# Altium project BlackChat Digital Final.PrjPCB
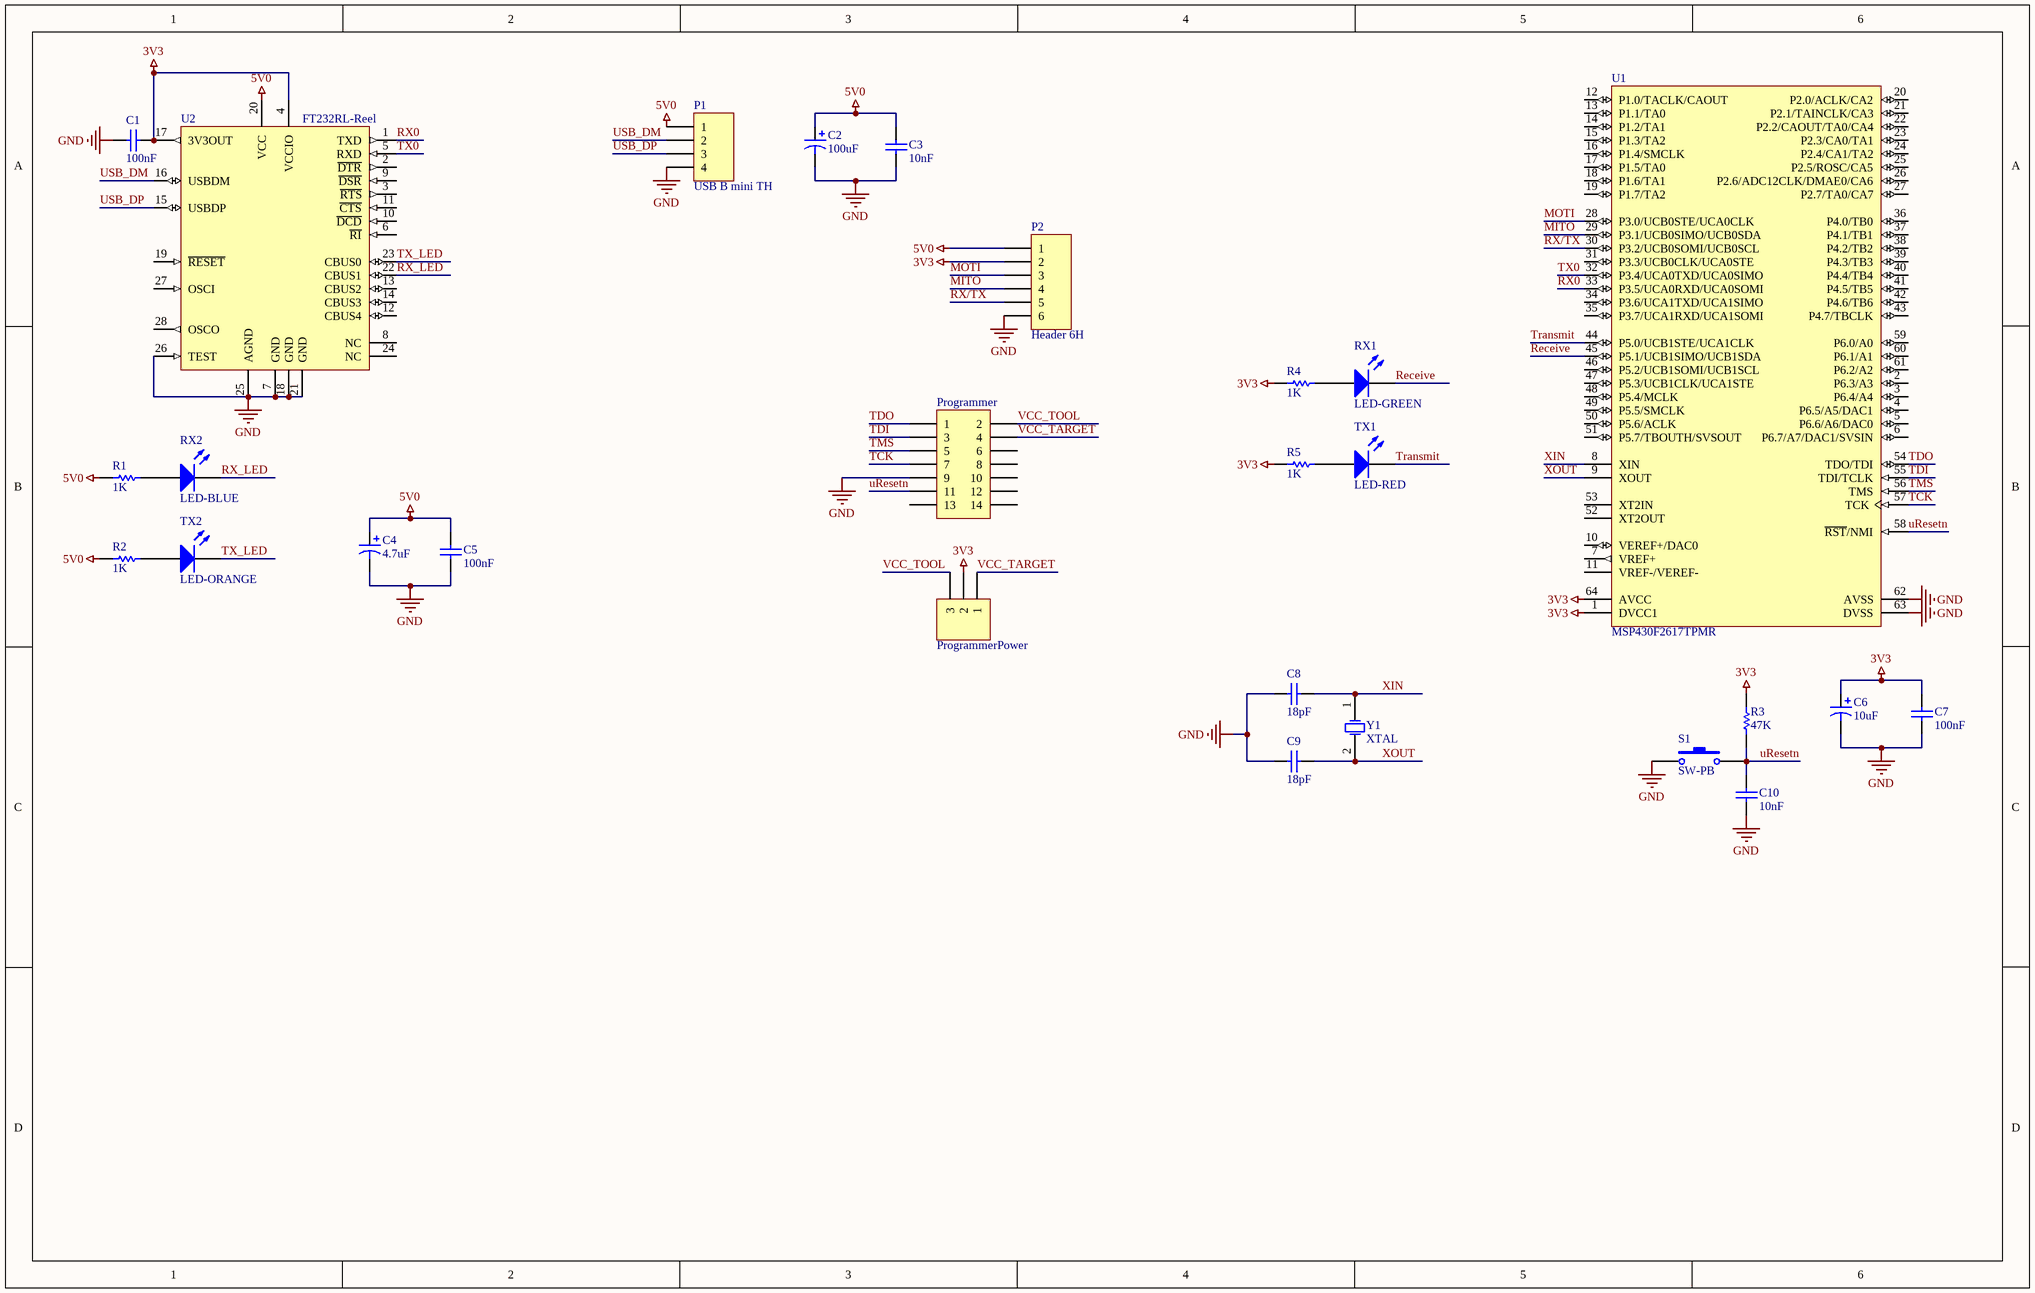
[diagram p0: Digital Final - BlackChat.SchDoc]
1 sheet, 27 parts. Net scope: global (net labels, ports and power ports of the same name join across sheets).
Board file: [R1] Digital - BlackChat.PcbDoc

## Sheet Digital Final - BlackChat.SchDoc
size B

### Parts
C1  value 100nF  [CAP-0805]  (hidden comment: Cap)
C2  value 100uF  [CAP-0805]  (hidden comment: Cap Pol3)
C3  value 10nF  [CAP-0805]  (hidden comment: Cap)
C4  value 4.7uF  [CAP-0805]  (hidden comment: Cap Pol3)
C5  value 100nF  [CAP-0805]  (hidden comment: Cap)
C6  value 10uF  [CAP-0805]  (hidden comment: Cap Pol3)
C7  value 100nF  [CAP-0805]  (hidden comment: Cap)
C8  value 18pF  [CAP-0805]  (hidden comment: Cap)
C9  value 18pF  [CAP-0805]  (hidden comment: Cap)
C10  value 10nF  [CAP-0805]  (hidden comment: Cap)
P1  USB B mini TH  [USB B mini Molex]
P2  Header 6H  [HDR1X6H]
Programmer  Header 7X2  [HDR2X7]  (value not drawn)
ProgrammerPower  Header 3  [HDR1X3]  (value not drawn)
R1  value 1K  [RES-0805]  (hidden comment: Res1)
R2  value 1K  [RES-0805]  (hidden comment: Res1)
R3  value 47K  [RES-0805]  (hidden comment: Res1)
R4  value 1K  [RES-0805]  (hidden comment: Res1)
R5  value 1K  [RES-0805]  (hidden comment: Res1)
RX1  LED-GREEN  [LED-0805]
RX2  LED-BLUE  [LED-0805]
S1  SW-PB  [SW PB]
TX1  LED-RED  [LED-0805]
TX2  LED-ORANGE  [LED-0805]
U1  MSP430F2617TPMR  [TI-PM64_N]
U2  FT232RL-Reel  [SSOP-28_N]
Y1  XTAL  [R38]

### Nets
3V3: C1.1 C6.1 C7.2 P2.2 ProgrammerPower.2 R3.2 R4.2 R5.2 U1.1(DVCC1) U1.64(AVCC) U2.4(VCCIO) U2.17(3V3OUT)
5V0: C2.1 C3.2 C4.1 C5.2 P1.1 P2.1 R1.2 R2.2 U2.20(VCC)
GND: C1.2 C2.2 C3.1 C4.2 C5.1 C6.2 C7.1 C8.2 C9.2 C10.1 P1.4 P2.6 Programmer.9 S1.1 U1.62(AVSS) U1.63(DVSS) U2.7(GND) U2.18(GND) U2.21(GND) U2.25(AGND) U2.26(TEST)
MITO: P2.4 U1.29(P3.1/UCB0SIMO/UCB0SDA)
MOTI: P2.3 U1.28(P3.0/UCB0STE/UCA0CLK)
Receive: RX1.2(K) U1.45(P5.1/UCB1SIMO/UCB1SDA)
RX0: U1.33(P3.5/UCA0RXD/UCA0SOMI) U2.1(TXD)
RX/~{TX}: P2.5 U1.30(P3.2/UCB0SOMI/UCB0SCL)
RX_LED: RX2.2(K) U2.22(CBUS1)
TCK: Programmer.7 U1.57(TCK)
TDI: Programmer.3 U1.55(TDI/TCLK)
TDO: Programmer.1 U1.54(TDO/TDI)
TMS: Programmer.5 U1.56(TMS)
Transmit: TX1.2(K) U1.44(P5.0/UCB1STE/UCA1CLK)
TX0: U1.32(P3.4/UCA0TXD/UCA0SIMO) U2.5(RXD)
TX_LED: TX2.2(K) U2.23(CBUS0)
uResetn: C10.2 Programmer.11 R3.1 S1.2 U1.58(~{RST}/NMI)
USB_DM: P1.2 U2.16(USBDM)
USB_DP: P1.3 U2.15(USBDP)
VCC_TARGET: Programmer.4 ProgrammerPower.1
VCC_TOOL: Programmer.2 ProgrammerPower.3
XIN: C8.1 U1.8(XIN) Y1.1(OSC1)
XOUT: C9.1 U1.9(XOUT) Y1.2(OSC2)
NetR1_1: R1.1 RX2.1(A)
NetR2_1: R2.1 TX2.1(A)
NetR4_1: R4.1 RX1.1(A)
NetR5_1: R5.1 TX1.1(A)

Not connected (* = marked no-connect by the designer): Programmer 6 8 10 12 13 14; U1 2(P6.3/A3) 3(P6.4/A4) 4(P6.5/A5/DAC1) 5(P6.6/A6/DAC0) 6(P6.7/A7/DAC1/SVSIN) 7(VREF+) 10(VEREF+/DAC0) 11(VREF-/VEREF-) 12(P1.0/TACLK/CAOUT) 13(P1.1/TA0) 14(P1.2/TA1) 15(P1.3/TA2) 16(P1.4/SMCLK) 17(P1.5/TA0) 18(P1.6/TA1) 19(P1.7/TA2) 20(P2.0/ACLK/CA2) 21(P2.1/TAINCLK/CA3) 22(P2.2/CAOUT/TA0/CA4) 23(P2.3/CA0/TA1) 24(P2.4/CA1/TA2) 25(P2.5/ROSC/CA5) 26(P2.6/ADC12CLK/DMAE0/CA6) 27(P2.7/TA0/CA7) 31(P3.3/UCB0CLK/UCA0STE) 34(P3.6/UCA1TXD/UCA1SIMO) 35(P3.7/UCA1RXD/UCA1SOMI) 36(P4.0/TB0) 37(P4.1/TB1) 38(P4.2/TB2) 39(P4.3/TB3) 40(P4.4/TB4) 41(P4.5/TB5) 42(P4.6/TB6) 43(P4.7/TBCLK) 46(P5.2/UCB1SOMI/UCB1SCL) 47(P5.3/UCB1CLK/UCA1STE) 48(P5.4/MCLK) 49(P5.5/SMCLK) 50(P5.6/ACLK) 51(P5.7/TBOUTH/SVSOUT) 52(XT2OUT) 53(XT2IN) 59(P6.0/A0) 60(P6.1/A1) 61(P6.2/A2); U2 2(~{DTR}) 3(~{RTS}) 6(~{RI}) 8(NC) 9(~{DSR}) 10(~{DCD}) 11(~{CTS}) 12(CBUS4) 13(CBUS2) 14(CBUS3) 19(~{RESET}) 24(NC) 27(OSCI) 28(OSCO)

### Library data of the parts
C1 C3 C5 C7-C10 = Cap: Capacitor; Published: 8-Jun-2000; LatestRevisionDate: 17-Jul-2002; LatestRevisionNote: Re-released for DXP Platform.; PackageReference: RAD-0.3; Publisher: Altium Limited; PackageDescription: Radial Cap, Thru-Hole; 2 Leads; 0.3 in Pin Spacing
C2 C4 C6 = Cap Pol3: Polarized Capacitor (Surface Mount); Published: 8-Jun-2000; LatestRevisionDate: 29-May-2009; LatestRevisionNote: IPC-7351 Footprint Added.; PackageReference: C0805; Publisher: Altium Limited; PackageDescription: Chip Capacitor
P2 = Header 6H: Header, 6-Pin, Right Angle; LatestRevisionDate: 17-Jul-2002; LatestRevisionNote: Re-released for DXP Platform.; Publisher: Altium Limited
Programmer = Header 7X2: Header, 7-Pin, Dual row; LatestRevisionDate: 17-Jul-2002; LatestRevisionNote: Re-released for DXP Platform.; Publisher: Altium Limited
ProgrammerPower = Header 3: Header, 3-Pin; LatestRevisionDate: 17-Jul-2002; LatestRevisionNote: Re-released for DXP Platform.; Publisher: Altium Limited
R1-R5 = Res1: Resistor; Published: 8-Jun-2000; LatestRevisionDate: 17-Jul-2002; LatestRevisionNote: Re-released for DXP Platform.; PackageReference: AXIAL-0.3; Publisher: Altium Limited; PackageDescription: Axial Device, Thru-Hole; 2 Leads; 0.3 in Pin Spacing
RX1 RX2 TX1 TX2 = LED-GENERIC: Light Emitting Diode
S1 = SW-PB: DIGIKEY SW400-ND; Published: 24-Mar-1999; LatestRevisionDate: 17-Jul-2002; LatestRevisionNote: Re-released for DXP Platform.; Publisher: Altium Limited
U1 = MSP430F2617TPMR: 16 MHz Mixed Signal Microcontroller with 92 KB Flash, 8192 B SRAM and 48 GPIOs, -40 to 105 degC, 64-pin QFP (PM), Green (RoHS & no Sb/Br); Manufacturer: Texas Instruments; ADC: 12-bit SAR; ADC Channels: 8; Brown Out Reset: Yes; DMA: 3; Flash(KB): 92; Frequency(MHz): 16; GPIO: 48; Multiplier: 16x16; SRAM(B): 8192; SubFamily: 2 Series, Extended Temp; Timers - 16-bit: 2; DatasheetVersion: SLAS541K; PackageVersion: 4040152/C; PackageReference: PM64; PackageDescription: 64-Pin Plastic Quad Flat Pack, Body 10 x 10 mm, Pitch 0.5 mm; Supplier 1: Digi-Key; Supplier Part Number 1: 296-26222-ND; Supplier 2: Farnell; Supplier Part Number 2: 1649453; Supplier 3: Newark; Supplier Part Number 3: 61M7904; Supplier 4: Mouser; Supplier Part Number 4: 595-MSP430F2617TPM; Comparators: Yes; Eco-Plan: Green (RoHS & no Sb/Br); SVS: Yes; Temp Sensor: Yes; USCI_A (UART/LIN/IrDA/SPI): 2; USCI_B (I2C & SPI): 2; Watchdog: Yes; Mounting Technology: Surface Mount; Code_JEDEC: MS-026; PartNumber: MSP430F2617TPMR; ComponentLink1Description: Manufacturer URL; ComponentLink1URL: http://www.ti.com/; ComponentLink2Description: Datasheet; ComponentLink2URL: http://www.ti.com/general/docs/lit/getliterature.tsp?genericPartNumber=MSP430F2617&fileType=pdf; ComponentLink3Description: Package Specification; ComponentLink3URL: http://www.ti.com/lit/ml/mtqf008a/mtqf008a.pdf
U2 = FT232RL-Reel: USB UART Asynchronous Serial Data Transfer Chip, SSOP-28, Tape and Reel; Published: 19-Aug-2010; DatasheetVersion: ver 2.07, Jul-2010; PackageVersion: 2010; PackageReference: SSOP-28; Publisher: Altium Limited; PackageDescription: 28-Pin Small Outline Package 0.65 mm Pitch; ComponentLink1Description: Manufacturer Link; ComponentLink1URL: http://www.ftdichip.com/Products/ICs/FT232R.htm; ComponentLink2Description: Datasheet; ComponentLink2URL: http://www.ftdichip.com/Support/Documents/DataSheets/ICs/DS_FT232R.pdf
Y1 = XTAL: Crystal Oscillator; Published: 8-Jun-2000; LatestRevisionDate: 17-Jul-2002; LatestRevisionNote: Re-released for DXP Platform.; PackageReference: R38; Publisher: Altium Limited; PackageDescription: Crystal, Thru-Hole; 2 Leads; Body 3.1 x 8.2 mm (Dia.xH)
P1 = USB B mini TH: LatestRevisionDate: 17-Jul-2002; LatestRevisionNote: Re-released for DXP Platform.; Publisher: Altium Limited; Digikey: WM17115-ND